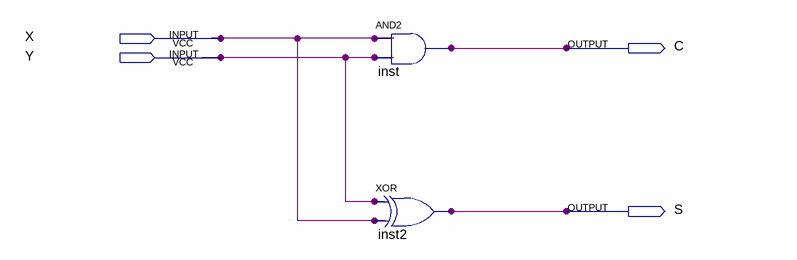
[diagram p0: schematic sheet]
// Quartus schematic half_adder.bdf as structural Verilog: 2 symbols, 4 pins
module half_adder (
  input  X,
  input  Y,
  output C,
  output S
);

  and inst (C, X, Y);
  xor inst2 (S, Y, X);
endmodule
